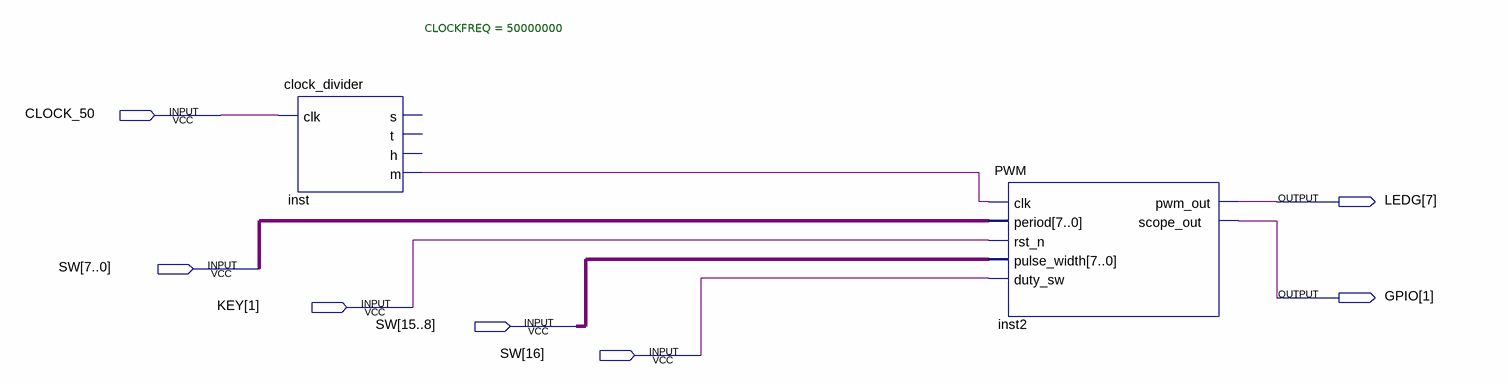
[diagram p0: schematic sheet]
// Quartus schematic PWM_Block.bdf as structural Verilog: 2 symbols, 7 pins
module PWM_Block (
  input  CLOCK_50,
  input  [16:0] SW,
  input  [1:1] KEY,
  output [7:7] LEDG,
  output [1:1] GPIO
);

  wire inst_m;

  clock_divider #(.CLOCKFREQ(50000000)) inst (.clk(CLOCK_50), .m(inst_m));  // open: s, t, h
  PWM inst2 (
    .clk(inst_m), .period(SW[7:0]), .rst_n(KEY[1]), .pulse_width(SW[15:8]), .duty_sw(SW[16]),
    .pwm_out(LEDG[7]), .scope_out(GPIO[1]));
endmodule
